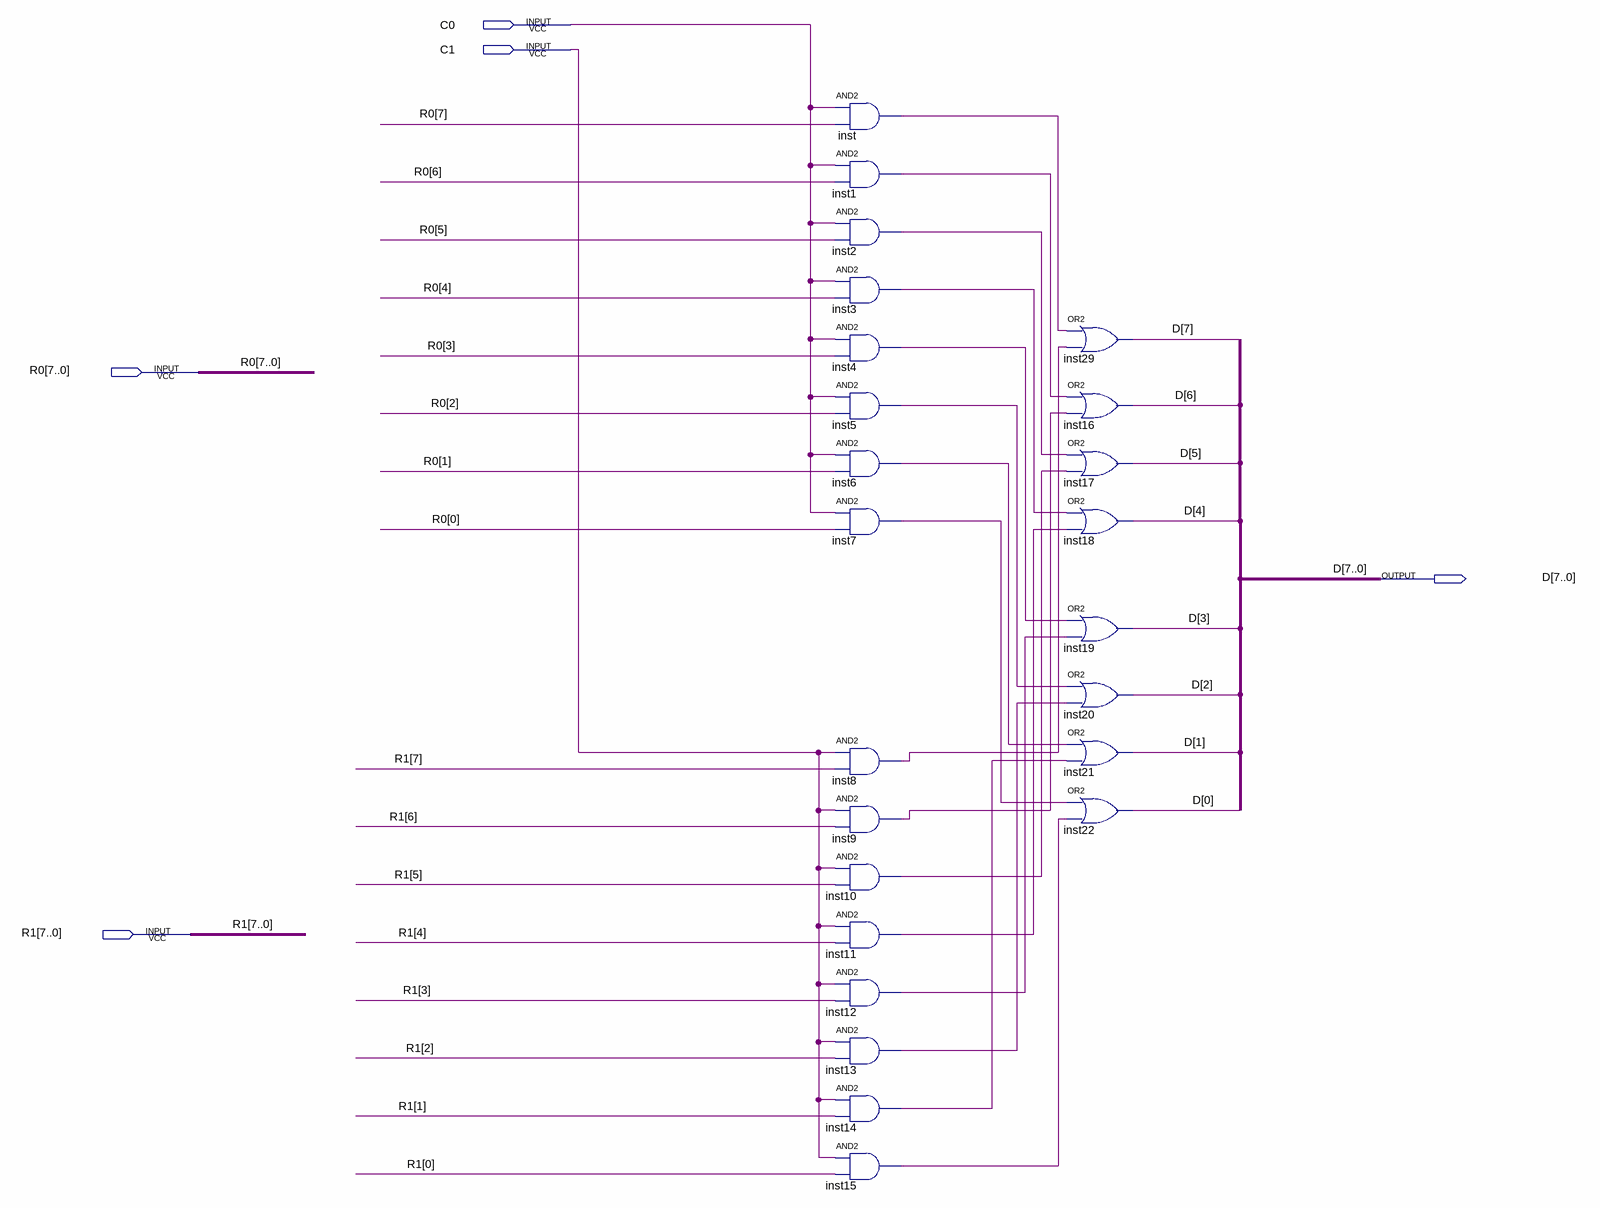
[diagram p0: schematic sheet]
// Quartus schematic Data_choose.bdf as structural Verilog: 24 symbols, 5 pins
module Data_choose (
  input  C0,
  input  C1,
  input  [7:0] R0,
  input  [7:0] R1,
  output [7:0] D
);

  wire inst1_out, inst2_out, inst3_out, inst4_out, inst5_out, inst6_out, inst7_out, inst8_out, inst9_out,
       inst10_out, inst11_out, inst12_out, inst13_out, inst14_out, inst15_out, inst_out;

  and inst (inst_out, C0, R0[7]);
  and inst1 (inst1_out, C0, R0[6]);
  and inst2 (inst2_out, C0, R0[5]);
  and inst3 (inst3_out, C0, R0[4]);
  and inst4 (inst4_out, C0, R0[3]);
  and inst5 (inst5_out, C0, R0[2]);
  and inst6 (inst6_out, C0, R0[1]);
  and inst7 (inst7_out, C0, R0[0]);
  and inst8 (inst8_out, C1, R1[7]);
  and inst9 (inst9_out, C1, R1[6]);
  and inst10 (inst10_out, C1, R1[5]);
  and inst11 (inst11_out, C1, R1[4]);
  and inst12 (inst12_out, C1, R1[3]);
  and inst13 (inst13_out, C1, R1[2]);
  and inst14 (inst14_out, C1, R1[1]);
  and inst15 (inst15_out, C1, R1[0]);
  or inst29 (D[7], inst_out, inst8_out);
  or inst16 (D[6], inst1_out, inst9_out);
  or inst17 (D[5], inst2_out, inst10_out);
  or inst18 (D[4], inst3_out, inst11_out);
  or inst19 (D[3], inst4_out, inst12_out);
  or inst20 (D[2], inst5_out, inst13_out);
  or inst21 (D[1], inst6_out, inst14_out);
  or inst22 (D[0], inst7_out, inst15_out);
endmodule
